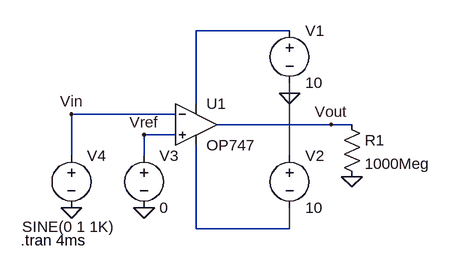
[diagram p0: schematic INVERTING_COMPARATOR.asc]
INVERTING_COMPARATOR.asc, the LTspice schematic file:
Version 4
SHEET 1 880 680
WIRE 320 -32 176 -32
WIRE 320 64 320 48
WIRE 176 80 176 -32
WIRE 144 96 -16 96
WIRE 384 112 208 112
WIRE 416 112 384 112
WIRE 144 128 96 128
WIRE -16 160 -16 96
WIRE 96 160 96 128
WIRE 320 160 320 64
WIRE 176 272 176 144
WIRE 320 272 320 240
WIRE 320 272 176 272
FLAG 320 64 0
FLAG -16 240 0
FLAG 96 240 0
FLAG 416 192 0
FLAG -16 96 Vin
FLAG 96 128 Vref
FLAG 384 112 Vout
SYMBOL OpAmps\\OP747 176 48 R0
SYMATTR InstName U1
SYMBOL voltage 320 -48 R0
WINDOW 123 0 0 Left 0
WINDOW 39 0 0 Left 0
SYMATTR InstName V1
SYMATTR Value 10
SYMBOL voltage 320 144 R0
WINDOW 123 0 0 Left 0
WINDOW 39 0 0 Left 0
SYMATTR InstName V2
SYMATTR Value 10
SYMBOL res 400 96 R0
SYMATTR InstName R1
SYMATTR Value 1000Meg
SYMBOL voltage 96 144 R0
WINDOW 123 0 0 Left 0
WINDOW 39 0 0 Left 0
SYMATTR InstName V3
SYMATTR Value 0
SYMBOL voltage -16 144 R0
WINDOW 3 -76 125 Left 2
WINDOW 123 0 0 Left 0
WINDOW 39 0 0 Left 0
SYMATTR InstName V4
SYMATTR Value SINE(0 1 1K)
TEXT -94 290 Left 2 !.tran 4ms

The netlist it stands for:
* INVERTING_COMPARATOR.asc
XU1 Vref Vin N001 N002 Vout OP747  ; pins In+ In- V+ V- OUT
V1 N001 0 10
V2 0 N002 10
R1 Vout 0 1000Meg
V3 Vref 0 0
V4 Vin 0 SINE(0 1 1K)
.tran 4ms
.backanno
.end